# EAGLE design MineralFire_v1 (EAGLE 7.7.0)
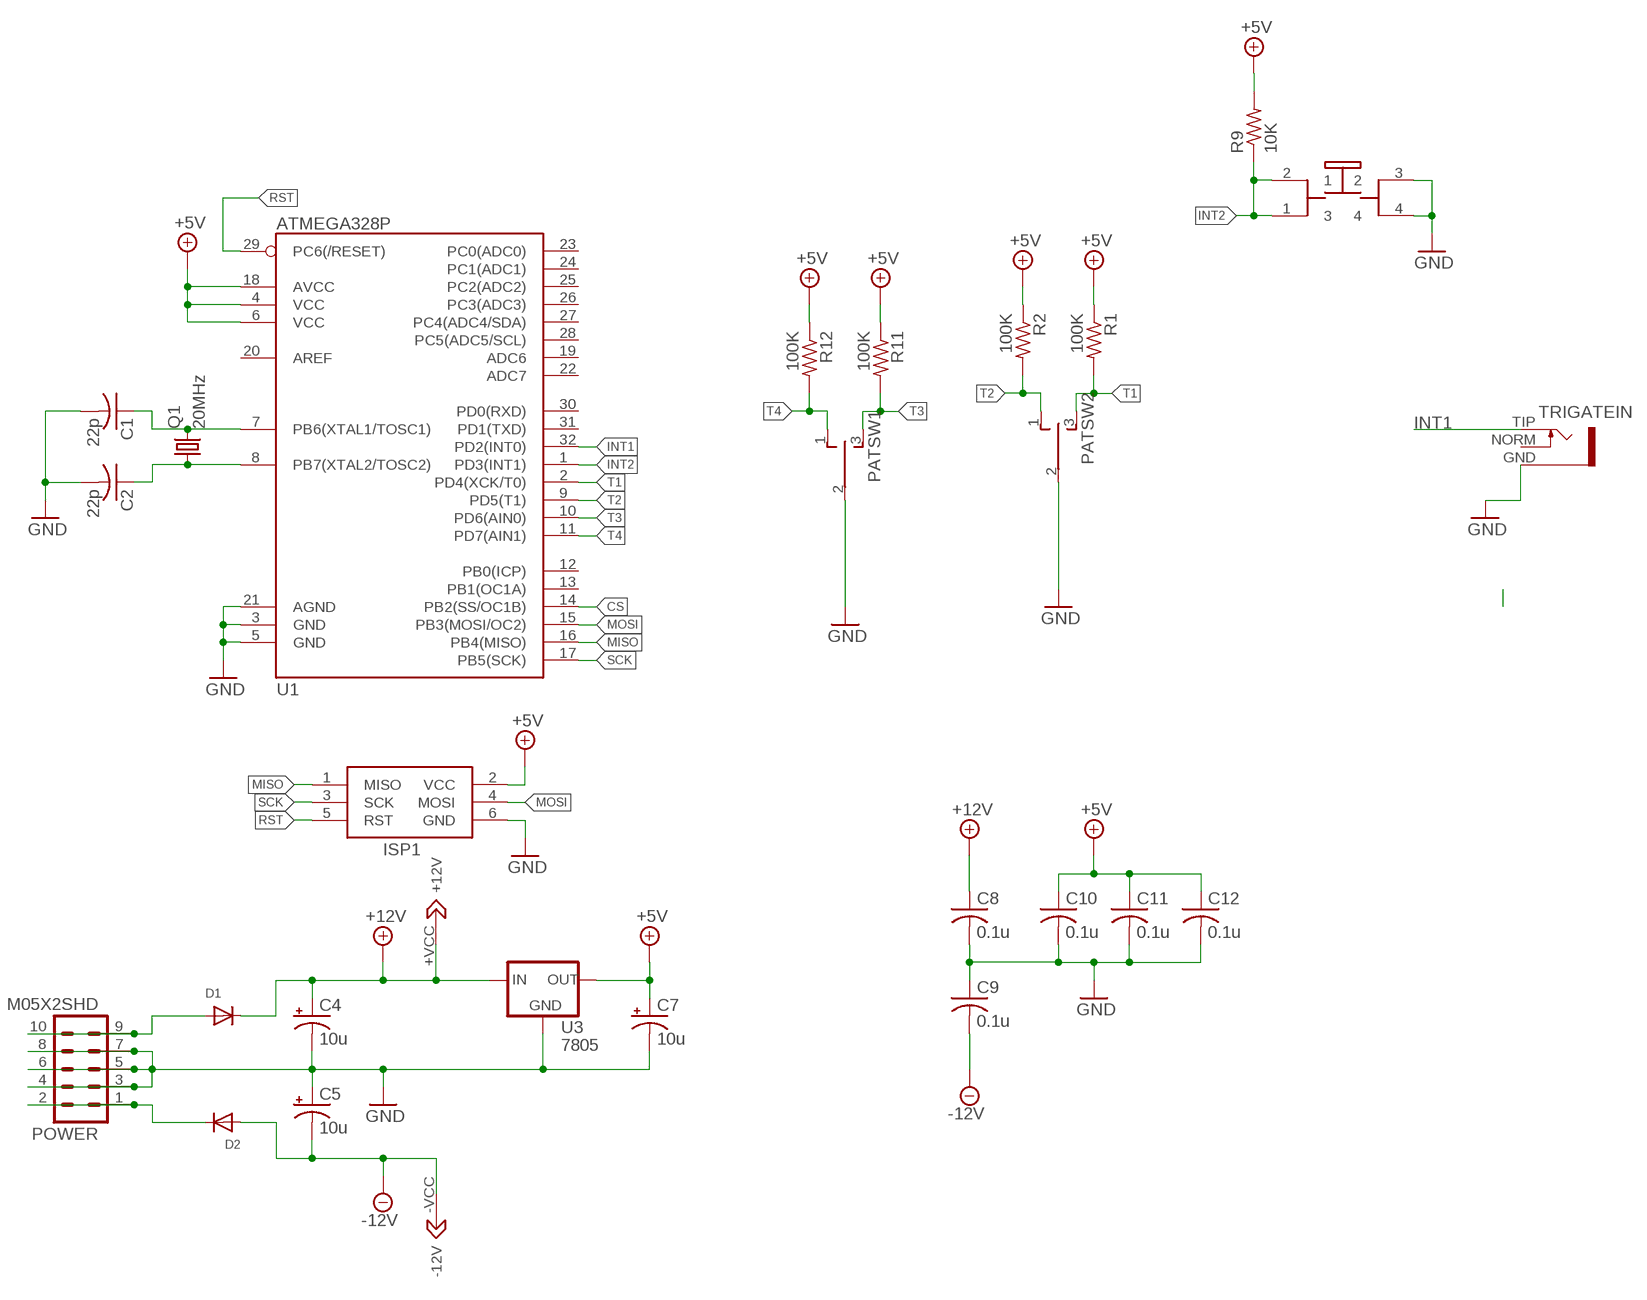
[diagram p0: schematic, sheet 1]

## Parts
BUT  PB6149L-5  [PB6149L]
C1  22p  C-USC0805K  [C0805K]
C2  22p  C-USC0805K  [C0805K]
C4  10u  CPOL-US153CLV-0505  [153CLV-0505]
C5  10u  CPOL-US153CLV-0505  [153CLV-0505]
C7  10u  CPOL-US153CLV-0505  [153CLV-0505]
C8  0.1u  C-USC0805K  [C0805K]
C9  0.1u  C-USC0805K  [C0805K]
C10  0.1u  C-USC0805K  [C0805K]
C11  0.1u  C-USC0805K  [C0805K]
C12  0.1u  C-USC0805K  [C0805K]
D1  DIODESMA  [SMADIODE]
D2  DIODESMA  [SMADIODE]
ISP1  AVRISP-6  [AVRISP]
PATSW1  TOGGLE_ON_OFF_ON  [TOGGLE_ON_OFF_ON]
PATSW2  TOGGLE_ON_OFF_ON  [TOGGLE_ON_OFF_ON]
POWER  M05X2SHD  [2X5-SHROUDED]
Q1  20MHz  CRYSTALHC49UP  [HC49UP]
R1  100K  R-US_R0805  [R0805]
R2  100K  R-US_R0805  [R0805]
R9  10K  R-US_R0805  [R0805]
R11  100K  R-US_R0805  [R0805]
R12  100K  R-US_R0805  [R0805]
TRIGATEIN  S_JACK  [S_JACK]
U1  ATMEGA328P  ATMEGA328_SMT  [TQFP32-08]
U2  DUAL_OPAMP  [DUAL_OPAMP]
U3  7805  V-REG  [V-REG]

## Nets
+5V: C7.+ C10.1 C11.1 C12.1 ISP1.2(VCC) R1.1 R2.1 R9.2 R11.1 R12.1 U1.4(VCC) U1.6(VCC) U1.18(AVCC) U3.3(OUT)
+12V: C4.+ C8.1 D1.C U2.+VCC(+12V) U3.1(IN)
-12V: C5.- C9.2 D2.A U2.-VCC(-12V)
CS: U1.14(PB2(SS/OC1B))
GND: BUT.3 BUT.4 C1.2 C2.2 C4.- C5.+ C7.- C8.2 C9.1 C10.2 C11.2 C12.2 ISP1.6(GND) PATSW1.2(P) PATSW2.2(P) POWER.3 POWER.4 POWER.5 POWER.6 POWER.7 POWER.8 TRIGATEIN.GND U1.3(GND) U1.5(GND) U1.21(AGND) U3.4(GND)
INT1: TRIGATEIN.TIP U1.32(PD2(INT0))
INT2: BUT.1 BUT.2 R9.1 U1.1(PD3(INT1))
MISO: ISP1.1(MISO) U1.16(PB4(MISO))
MOSI: ISP1.4(MOSI) U1.15(PB3(MOSI/OC2))
N$1: C1.1 Q1.2 U1.7(PB6(XTAL1/TOSC1))
N$2: C2.1 Q1.1 U1.8(PB7(XTAL2/TOSC2))
N$9: D1.A POWER.9 POWER.10
N$10: D2.C POWER.1 POWER.2
RST: ISP1.5(RST) U1.29(PC6(/RESET))
SCK: ISP1.3(SCK) U1.17(PB5(SCK))
T1: PATSW2.3(S) R1.2 U1.2(PD4(XCK/T0))
T2: PATSW2.1(O) R2.2 U1.9(PD5(T1))
T3: PATSW1.3(S) R11.2 U1.10(PD6(AIN0))
T4: PATSW1.1(O) R12.2 U1.11(PD7(AIN1))
Unconnected: BUT.A BUT.K(C) TRIGATEIN.NORM U1.12(PB0(ICP)) U1.13(PB1(OC1A)) U1.19(ADC6) U1.20(AREF) U1.22(ADC7) U1.23(PC0(ADC0)) U1.24(PC1(ADC1)) U1.25(PC2(ADC2)) U1.26(PC3(ADC3)) U1.27(PC4(ADC4/SDA)) U1.28(PC5(ADC5/SCL)) U1.30(PD0(RXD)) U1.31(PD1(TXD)) U2.1OUT(OUT) U2.2OUT(OUT) U2.+1IN(+IN) U2.+2IN(+IN) U2.-1IN(-IN) U2.-2IN(-IN)

## Library data of the parts
BUT = INSTRUO:PB6149L-5
C1 C2 C8-C12 = rcl:C-US: CAPACITOR, American symbol
C4 C5 C7 = rcl:CPOL-US: POLARIZED CAPACITOR, American symbol
D1 D2 = adafruit:DIODE: Diode SMADIODE - SMA Surface Mount Package 20V 1A Schottky Diode Digikey: 641-1014-6-ND DO-1N4148 - Through Hole Small Current Diode SOD-123 20V 1 A (.5mV Vf) Schottky Diode - Digikey: MBRX120TPMSCT-ND SOD-323 10V 570mA (.38mV Vf, 3ns) Schottky Diode - Digikey: ZLLS410CT-ND SOD-523 30V 30mA Schottky Diode (RB751S-40TE61) - Digikey: RB751S-40TE61CT-ND SOT23-R/W - SOT23 Package (R = Solder Paste/Reflow Ovens, W = Hand-Soldering) BAT54Film 40V 300mA - Digikey: 497-7162-1-ND
ISP1 = adafruit:AVRISP: AVR ISP HEADER Standard 6 pin header for AVR programming
PATSW1 PATSW2 = INSTRUO:TOGGLE_ON_OFF_ON
POWER = SparkFun-Connectors:M05X2: Header 5x2 Standard 10-pin dual row 0.1" header. Commonly used with AVR-ISP. Use with Spark Fun Electronics SKU: PRT-00778
Q1 = adafruit:CRYSTAL: CRYSTAL; OC_FARNELL: unknown; OC_NEWARK: unknown
R1 R2 R9 R11 R12 = rcl:R-US_: RESISTOR, American symbol
TRIGATEIN = INSTRUO:S_JACK
U1 = SparkFun-DigitalIC:ATMEGA328_SMT: 32-Pin Atmega328 part Commonly used on Arduino compatible boards Available in QFP and QFN packages TQFP is IC-09069 QFN is non-stock; PROD_ID: IC-09069
U2 = INSTRUO:DUAL_OPAMP
U3 = INSTRUO:V-REG

## Board
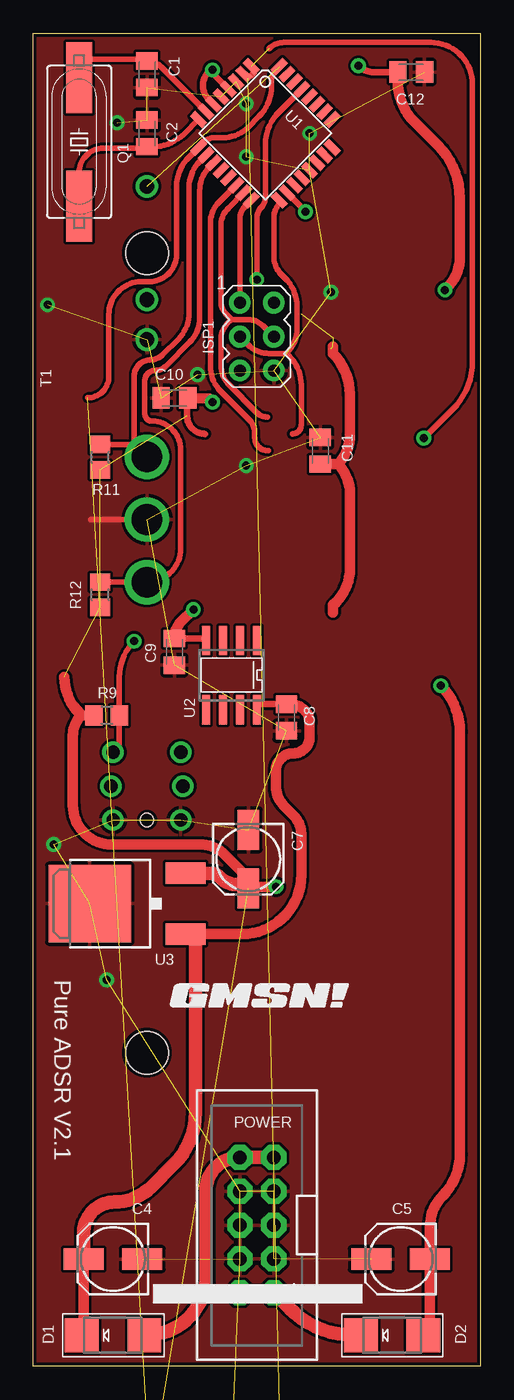
[diagram p1: board, top side]
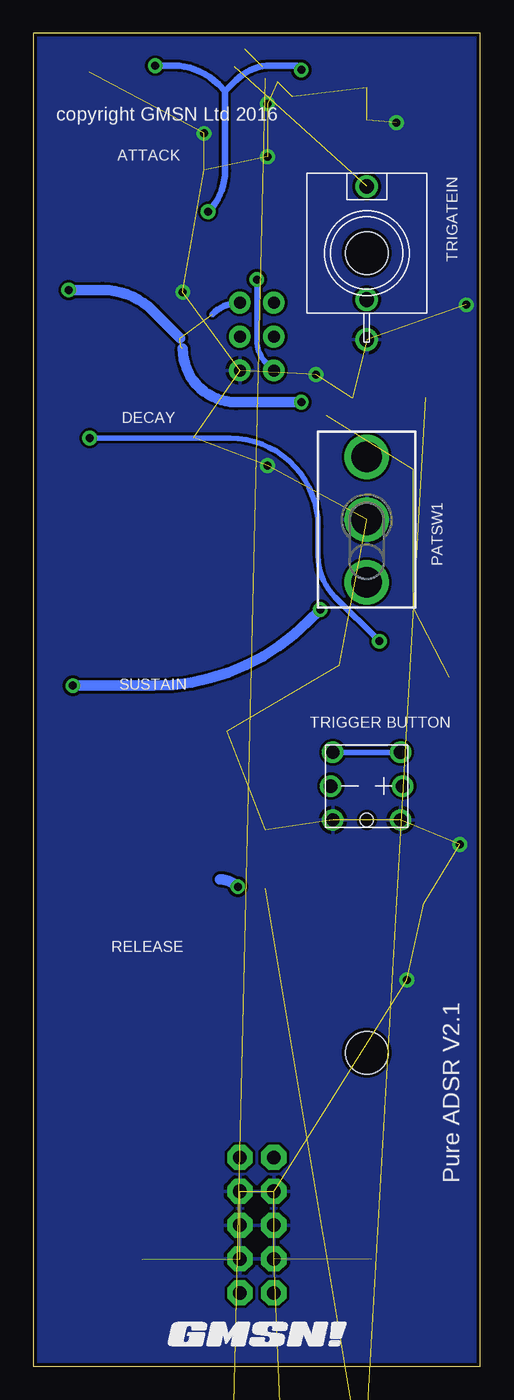
[diagram p2: board, bottom side, seen from below]

Size 33.56 x 100 mm. Coordinates in mm from the lower left corner, seen from the top.
Outline: 33.56,0 0,0 0,100 33.56,100 33.56,0
Copper layers (1*16): Top 0.035mm / dielectric 1.5mm / Bottom 0.035mm
Design rules "SparkFun": minimum track width 8mil, minimum drill 20mil, track to track 8mil, track to pad 8mil, pad to pad 8mil, via to via 8mil, smd to smd 8mil, copper to edge 10mil, drill to drill 8mil, minimum pad ring 12mil, minimum via ring 10mil, stop-mask expansion 4mil, vias tented up to drill 25mil, thermal gap 10mil
Holes 3.2 mm at 8.53,23.52 8.53,83.52

### Footprints (pad centres in the part's own frame; a part is rotated, then mirrored left to right if it is on the bottom)
PB6149L = drill 1: 1 2.54,-2.54; 2 2.54,2.54; 3 -2.54,-2.54; 4 -2.54,2.54; A 0,-2.7; K 0,2.7 | hole 1: -2.54,0
C0805K = smd 1.3 x 1.6: 1 -1,0; 2 1,0
153CLV-0505 = smd 3 x 1.6: + 2.2,0; - -2.2,0
SMADIODE = smd 2.54 x 2.54: A 2.349,0; C -2.349,0
AVRISP = drill 0.9 pad 1.626: 1 -1.27,2.54; 2 1.27,2.54; 3 -1.27,0; 4 1.27,0; 5 -1.27,-2.54; 6 1.27,-2.54
TOGGLE_ON_OFF_ON = drill 2.3: 1 -4.7,0; 2 0,0; 3 4.7,0
2X5-SHROUDED = drill 1.016 pad 1.88 octagon: 1 -1.27,5.08; 2 1.27,5.08; 3 -1.27,2.54; 4 1.27,2.54; 5 -1.27,0; 6 1.27,0; 7 -1.27,-2.54; 8 1.27,-2.54; 9 -1.27,-5.08; 10 1.27,-5.08
HC49UP = smd 5.334 x 1.93: 1 -4.826,0; 2 4.826,0
R0805 = smd 1.3 x 1.5: 1 -0.95,0; 2 0.95,0
S_JACK = drill 1.1: GND 0,-6.5; NORM 0,-3.5; TIP 0,5
TQFP32-08 = smd 1.27 x 0.559: 1 -4.293,2.8; 2 -4.293,2; 3 -4.293,1.2; 4 -4.293,0.4; 5 -4.293,-0.4; 6 -4.293,-1.2; 7 -4.293,-2; 8 -4.293,-2.8; 17 4.293,-2.8; 18 4.293,-2; 19 4.293,-1.2; 20 4.293,-0.4; 21 4.293,0.4; 22 4.293,1.2; 23 4.293,2; 24 4.293,2.8 | smd 0.559 x 1.27: 9 -2.8,-4.293; 10 -2,-4.293; 11 -1.2,-4.293; 12 -0.4,-4.293; 13 0.4,-4.293; 14 1.2,-4.293; 15 2,-4.293; 16 2.8,-4.293; 25 2.8,4.293; 26 2,4.293; 27 1.2,4.293; 28 0.4,4.293; 29 -0.4,4.293; 30 -1.2,4.293; 31 -2,4.293; 32 -2.8,4.293
DUAL_OPAMP = smd 2.2 x 0.6: 1OUT -2.6,1.905; 2OUT 2.6,0.635; +1IN -2.6,-0.635; +2IN 2.6,-1.905; +VCC 2.6,1.905; -1IN -2.6,0.635; -2IN 2.6,-0.635; -VCC -2.6,-1.905
V-REG = smd 1.6 x 3: 1 -2.28,-4.8; 3 2.28,-4.8 | smd 5.8 x 6.2: 4 0,2.38

### Placement (x,y rotation side)
BUT  8.53,43.52 90 bottom
C1  8.53,96.94 270 top
C2  8.53,92.49 90 top
C4  5.99,8.04 180 top
C5  27.57,8.04 180 top
C7  16.14,38.04 270 top
C8  19,48.67 270 top
C9  10.59,53.6 90 top
C10  10.59,72.65 180 top
C11  21.54,68.68 90 top
C12  28.37,97.09 0 top
D1  5.99,2.32 0 top
D2  26.94,2.32 0 top
ISP1  16.78,77.25 0 top
PATSW1  8.53,63.52 90 bottom
PATSW2  14.24,-21.81 0 top  (outside the outline)
POWER  16.78,10.58 180 top
Q1  3.45,91.85 90 top
R1  -3.54,-42.13 0 top  (outside the outline)
R2  4.08,-42.13 0 top  (outside the outline)
R9  5.51,48.83 180 top
R11  5.03,68.2 90 top
R12  5.03,57.88 90 top
TRIGATEIN  8.53,83.52 0 bottom
U1  17.41,92.49 315 top
U2  14.88,51.85 270 top
U3  6.62,34.7 90 top
U$1  [GMSN!_LOGO]  16.46,2.32 0 bottom
U$2  [GMSN!_LOGO]  17.26,27.72 0 top

### Tracks (layer width: path | path; a pad name or v marks a point on that pad's centre or on a via)
+5V  (via drill 0.6)  (8 unrouted)
  Top 0.5: 21.27,67.41 C11.1 | U1.6 13.17,95.04 arc-90 13.17,97.14 13.29,97.25 v13.45,97.25 13.45,97.02 U1.4 | v24.4,97.57 arc45 25.55,97.09 C12.1 | U1.18 20.43,86.64 v20.43,86.62 | 12.91,69.95 arc-90 11.54,71.31 11.54,72.6 C10.1
  Top 0.8: 22.5,56.55 22.5,57.09 22.74,57.34 arc45 23.77,59.8 23.77,65.49 arc45 22.86,67.68 | 22.86,67.68 C11.1 | 22.5,76.48 22.5,75.98 arc-45 23.77,72.91 23.77,69.86 arc-45 22.86,67.68 | C12.1 27.37,96.35 arc45 28.6,93.37 30.38,91.59 arc-45 32.02,87.63 32.02,83.24 arc-45 31.04,80.87 v30.91,80.74 | C10.1 13.18,72.6 v13.45,72.33 | 16.28,35.97 16.28,36.79 16.14,36.93 15.83,36.93 14.4,38.35 arc45 12.47,39.15 5.89,39.15 arc-90 2.97,42.07 2.97,47.3 arc-45 3.6,48.83 | 3.6,48.83 R9.2 | 2.34,51.7 arc45 3.47,48.97 3.6,48.83 | v18.21,35.97 16.28,35.97 | 16.28,35.97 C7.+
  Top 1.016: U3.3 13.25,36.98 arc-45 14.03,36.67 arc45 15.31,36.13 15.85,36.13 C7.+
  Bottom 0.5: ISP1.2 arc-45 20.12,78.93 | v13.45,97.25 13.76,97.57 15.74,97.57 arc-45 18.33,96.5 19.16,95.66 | 19.16,95.66 19.67,96.17 arc-45 23.04,97.57 v24.4,97.57 | v20.43,86.62 arc-45 19.16,89.68 19.16,95.66
  Bottom 0.8: v18.21,35.97 arc-45 19.52,36.52 | v30.91,80.74 28.38,80.74 arc45 24.57,79.16 22.53,77.13 | v13.45,72.33 18.34,72.33 arc90 22.34,76.33
+12V
  Top 0.5: U2.+VCC 16.78,49.79 16.89,49.67 C8.1
  Top 0.8: D1.C 3.79,2.47 C4.+ | U3.1 15.68,32.42 arc90 20.11,36.86 20.11,39.91 arc45 19.53,41.33 18.82,42.04 arc-45 18.21,43.5 18.21,44.68 arc-90 19.51,45.98 arc90 20.75,47.22 20.75,48.28 arc90 19.4,49.63 19.05,49.63 C8.1
  Top 1.016: C4.+ 3.79,10 arc-90 6.11,12.32 arc45 8.88,13.47 10.59,15.18 arc45 12.18,19.01 12.18,32.17 12.34,32.32 11.52,32.32 U3.1
-12V  (via drill 0.6)
  Top 0.5: U2.-VCC 12.82,54.6 C9.2
  Top 0.8: D2.A 29.77,2.8 C5.- 29.77,10.45 arc-45 30.74,12.79 arc45 32.02,15.87 32.02,47.61 arc45 v30.59,51.06 | v12.02,56.77 11.1,55.86 arc45 10.59,54.62 C9.2
  Bottom 0.8: v30.59,51.06 24.53,51.06 arc-45 12.92,55.86 v12.02,56.77
CS
  Top 0.4: U1.14 13.94,87.32 arc45 13.29,85.74 13.29,75.04 arc45 14.08,73.12 16.26,70.95 arc-45 16.62,70.07 16.62,69.69 arc90 17.64,68.68
GND  (via drill 0.6)  (35 unrouted)
  Top 0.4: 4.32,63.52 PATSW1.2
  other vias: 1.06,79.63 1.54,39.15 5.51,28.99 12.34,74.39 15.99,67.57 22.34,80.58 20.75,92.49 15.99,94.71 15.99,90.74 6.3,93.28
  pour Bottom: 33.56,100 0,100 0,0 33.56,0
  pour Top: 33.56,100 0,100 0,0 33.56,0
INT1  (1 unrouted)
INT2  (via drill 0.6)  (1 unrouted)
  Top 0.4: v7.57,54.39 arc45 6.46,51.7 R9.1 6.46,46.53 BUT.1 | v29.32,69.63 31.48,71.79 arc45 32.97,75.38 32.97,96.17 arc90 29.83,99.32 18.82,99.32 arc45 17.71,98.85
  Bottom 0.4: v7.57,54.39 10.91,57.72 arc45 12.18,60.79 12.18,63.01 arc-90 18.8,69.63 v29.32,69.63 | BUT.1 BUT.2
MISO
  Top 0.4: U1.16 15.89,87 arc45 15.51,86.09 ISP1.1
MOSI
  Top 0.4: U1.15 14.64,86.89 arc45 14.08,85.54 14.08,79.91 arc45 14.5,78.89 14.88,78.52 | 14.88,78.52 16.13,78.52 arc-45 17.24,78.06 ISP1.4 | 17.58,71.22 arc-45 16.76,71.56 14.69,73.63 arc-45 14.08,75.09 14.08,77.05 arc-45 14.56,78.2 14.88,78.52
N$1
  Top 0.4: U1.7 9.58,97.5 arc45 C1.1 8.41,98.05 3.6,98.05 3.45,97.89 Q1.2
N$2
  Top 0.4: U1.8 11.3,92.45 arc-45 8.99,91.49 C2.1 8.41,91.38 5.25,91.38 arc90 3.45,89.57 Q1.1
N$9
  Top 1.016: POWER.9 POWER.10 15.44,15.65 arc90 12.97,13.18 12.97,6.79 arc-90 8.5,2.32 D1.A
N$10
  Top 1.016: POWER.2 POWER.1 19.18,4.37 arc45 24.12,2.32 D2.C
RST  (via drill 0.6)
  Top 0.4: U1.29 18.43,94.07 arc45 17.41,91.63 17.41,87.65 arc-45 17.13,86.97 arc45 16.78,86.12 v16.78,81.54
  Bottom 0.4: v16.78,81.54 16.78,76.96 arc-45 16.09,75.29 ISP1.5
SCK
  Top 0.4: ISP1.3 16.12,76.64 arc45 17.71,75.98 19,75.98 | 19,75.98 19.05,76.02 arc45 19.8,77.83 19.8,79.49 arc45 18.91,81.63 18.61,81.93 arc-45 18.05,83.28 18.05,86.18 arc-45 18.47,87.19 U1.17 | 19.44,69.95 arc90 20.11,70.62 20.11,73.6 arc45 19.22,75.76 19,75.98
T1  (2 unrouted)
  Top 0.4: 16.37,97.5 16.62,97.25 16.62,97.09 16.3,96.78 16.12,96.62 U1.2
T2  (2 unrouted)
  Top 0.4: 4.09,72.66 arc90 5.67,74.24 5.67,78.89 arc-90 8.15,81.38 8.71,81.38 arc90 10.75,83.41 10.75,88.46 arc-45 11.68,90.72 U1.9 12.81,91.85 arc-45 13.6,92.17 14.23,92.17 arc45 16.14,92.96 16.96,93.78 arc45 17.89,96.03 17.89,96.52 arc-45 18.18,97.23 18.46,97.5
T3
  Top 0.4: U1.10 12.5,90.41 arc45 11.7,88.47 11.7,79.03 arc-45 10.89,77.07 9.68,75.87 arc-45 8.8,75.5 arc90 7.57,74.27 7.57,69.18 7.6,69.15 | R11.2 7.6,69.15 | 7.6,69.15 PATSW1.3
T4
  Top 0.4: U1.11 13.24,90.01 arc45 12.49,88.21 12.49,78.63 arc-45 11.74,76.82 9.97,75.05 arc-45 9.16,74.71 arc90 8.37,73.92 8.37,71.47 arc90 8.94,70.9 arc-90 11.06,68.77 11.06,61.35 arc-90 8.54,58.83 PATSW1.1 8.52,58.83 R12.2

### Text on the board
tPlace: T1 | Pure ADSR V2.1 | POWER
bPlace: copyright GMSN Ltd 2016 | ATTACK | DECAY | SUSTAIN | TRIGGER BUTTON | RELEASE | Pure ADSR V2.1